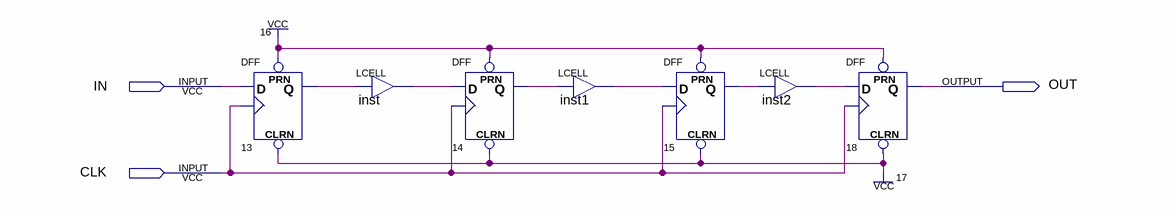
[diagram p0: schematic sheet]
// Quartus schematic sr4.bdf as structural Verilog: 7 symbols, 3 pins
module sr4 (
  input  IN,
  input  CLK,
  output OUT
);

  wire inst1_out, inst2_out, inst_out, n13_q, n14_q, n15_q;

  DFF u_13 (.CLRN(1'b1), .CLK(CLK), .D(IN), .PRN(1'b1), .Q(n13_q));
  LCELL inst (.IN(n13_q), .OUT(inst_out));
  DFF u_14 (.CLRN(1'b1), .CLK(CLK), .D(inst_out), .PRN(1'b1), .Q(n14_q));
  LCELL inst1 (.IN(n14_q), .OUT(inst1_out));
  DFF u_15 (.CLRN(1'b1), .CLK(CLK), .D(inst1_out), .PRN(1'b1), .Q(n15_q));
  LCELL inst2 (.IN(n15_q), .OUT(inst2_out));
  DFF u_18 (.CLRN(1'b1), .CLK(CLK), .D(inst2_out), .PRN(1'b1), .Q(OUT));
endmodule
